# Altium schematic sheet Proyecto_Multicapa_Schematic_2.SchDoc
size Letter; DrawnBy: Stefano Papadopolo; Organization: UVG; Revision: 0; SheetNumber: 2; SheetTotal: 2
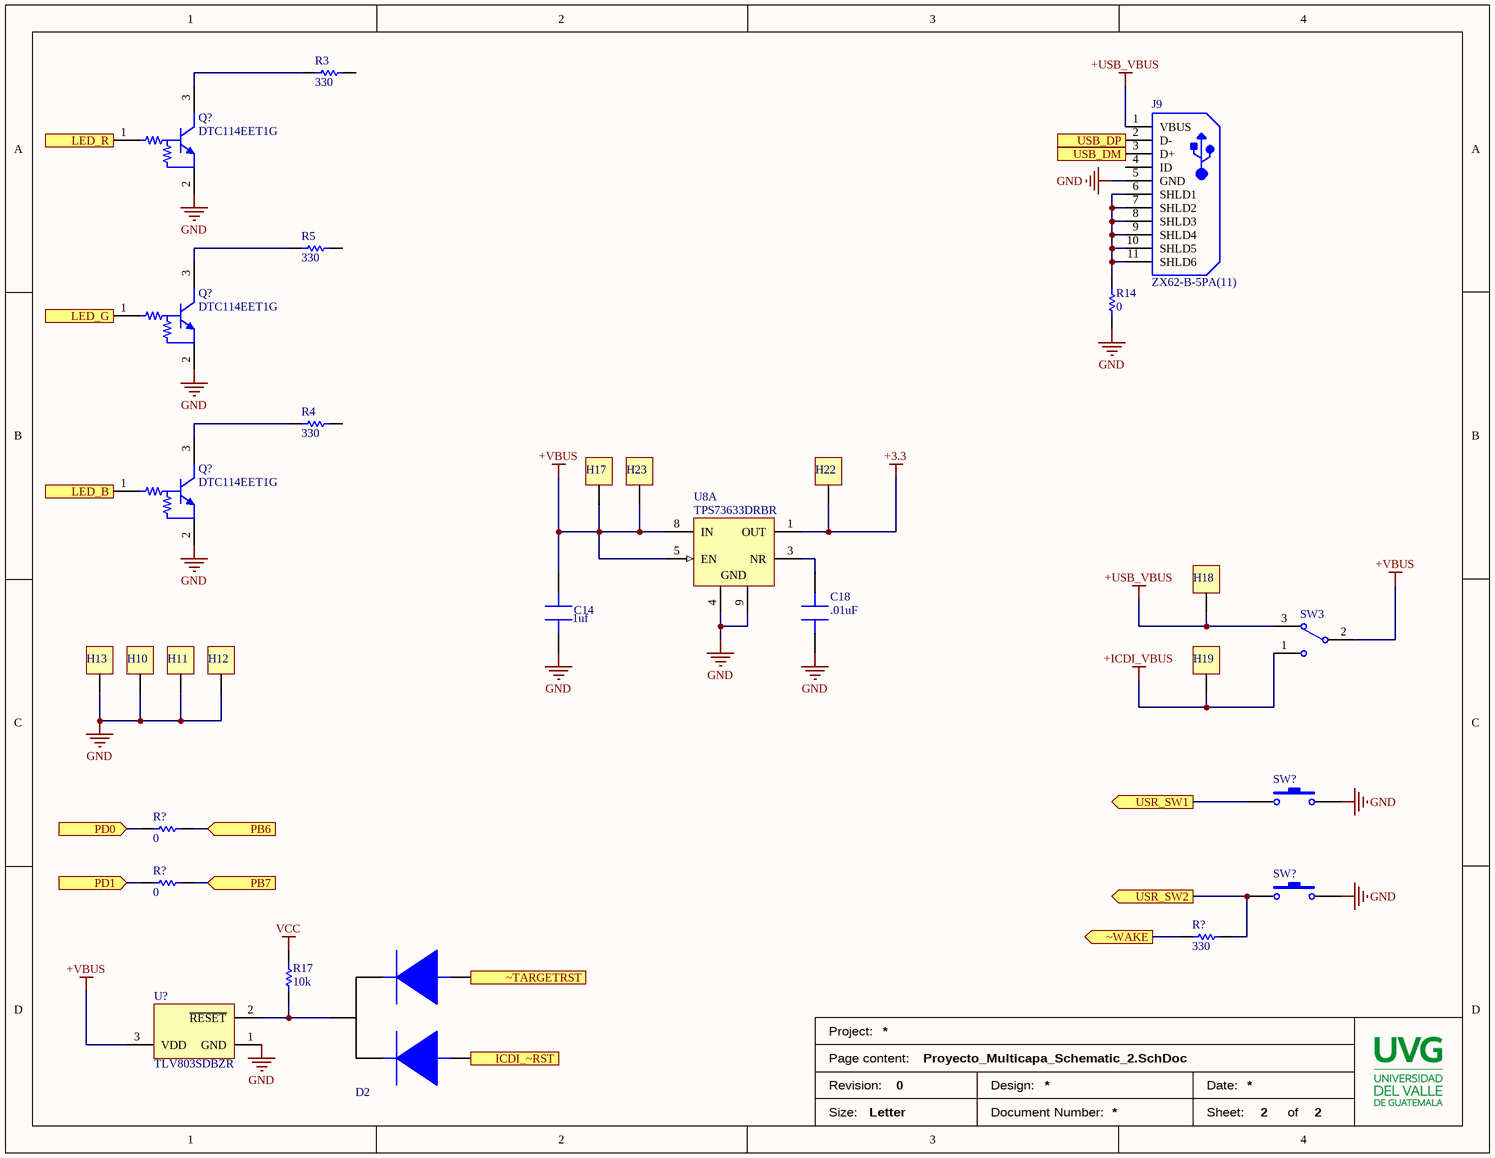
[diagram p0: Proyecto_Multicapa_Schematic_2.SchDoc]

## Parts
(Parts that share a designator on the sheet are numbered #1, #2 ... from top to bottom, then left to right.)
C14  1uf  [C0402]
C18  .01uF  [C0402]
D2  Diode, Dual Schottky, SC70  [Diode, dual shottky]  (value not drawn)
H10  HDR1  [HDR 1X1]  (value not drawn)
H11  HDR1  [HDR 1X1]  (value not drawn)
H12  HDR1  [HDR 1X1]  (value not drawn)
H13  HDR1  [HDR 1X1]  (value not drawn)
H17  HDR1  [HDR 1X1]  (value not drawn)
H18  HDR1  [HDR 1X1]  (value not drawn)
H19  HDR1  [HDR 1X1]  (value not drawn)
H22  HDR1  [HDR 1X1]  (value not drawn)
H23  HDR1  [HDR 1X1]  (value not drawn)
J9  ZX62-B-5PA(11)  [HIRO-ZX62-B-5PA_V]
Q?#1  DTC114EET1G  [ONSC-SC-75-3-463-01_V]
Q?#2  DTC114EET1G  [ONSC-SC-75-3-463-01_V]
Q?#3  DTC114EET1G  [ONSC-SC-75-3-463-01_V]
R3  330  [Resis 1M]
R4  330  [Resis 1M]
R5  330  [Resis 1M]
R14  0  [Resis 1M]
R17  10k  [Resis 1M]
R?#1  0  [Resis 1M]
R?#2  0  [Resis 1M]
R?#3  330  [Resis 1M]
SW3  SW-SPDT  [TL36WW15050]  (value not drawn)
SW?#1  SW-PB  [SPST-2]  (value not drawn)
SW?#2  SW-PB  [SPST-2]  (value not drawn)
U8  TPS73633DRBR  [DRB0008A_V]  (part A of 2)
U?  TLV803SDBZR  [DBZ0003A_M]

## Ports
ICDI_~RST (out), LED_B (out), LED_G (out), LED_R (out), PB6 (in), PB7 (in), PD0 (in), PD1 (in), USB_DM (out), USB_DP (out), USR_SW1 (out), USR_SW2 (out), ~TARGETRST (out), ~WAKE (out)

## Nets
+3.3: H22.1 U8.1(OUT)
+ICDI_VBUS: H19.1 SW3.1
+USB_VBUS: H18.1 J9.1(VBUS) SW3.3
+VBUS: C14.1 H17.1 H23.1 SW3.2 U8.5(EN) U8.8(IN) U?.3(VDD)
GND: C14.0 C18.0 H10.1 H11.1 H12.1 H13.1 J9.5(GND) Q?#1.2(E) Q?#2.2(E) Q?#3.2(E) R14.1 SW?#1.2 SW?#2.2 U8.4(GND) U8.9(GND) U?.1(GND)
VCC: R17.2
ICDI_~RST: D2.1 ; port ICDI_~RST
LED_B: Q?#3.1(B) ; port LED_B
LED_G: Q?#2.1(B) ; port LED_G
LED_R: Q?#1.1(B) ; port LED_R
PB6: R?#1.2 ; port PB6
PB7: R?#2.2 ; port PB7
PD0: R?#1.1 ; port PD0
PD1: R?#2.1 ; port PD1
USB_DM: J9.3(D+) ; port USB_DM
USB_DP: J9.2(D-) ; port USB_DP
USR_SW1: SW?#1.1 ; port USR_SW1
USR_SW2: R?#3.2 SW?#2.1 ; port USR_SW2
~TARGETRST: D2.2 ; port ~TARGETRST
~WAKE: R?#3.1 ; port ~WAKE
NetC18_1: C18.1 U8.3(NR)
NetD2_3: D2.3 R17.1 U?.2(~{RESET})
NetJ9_6: J9.6(SHLD1) J9.7(SHLD2) J9.8(SHLD3) J9.9(SHLD4) J9.10(SHLD5) J9.11(SHLD6) R14.2
NetQ?#1_3: Q?#1.3(C) R3.1
NetQ?#2_3: Q?#2.3(C) R5.1
NetQ?#3_3: Q?#3.3(C) R4.1

Not connected (* = marked no-connect by the designer): J9 4(ID); R3 2; R4 2; R5 2

## Notes on the sheet
- Project:
- Page content:
- Revision:
- Size:
- Letter
- Design:
- Document Number:
- Date:
- Sheet:
- of

## Library data of the parts
C14 = 100R07X105KV4T: Multilayer Ceramic Capacitor, Tanceram Series, 1 - F, - 10%, X5R, 10 V, 0402 [1005 Metric]; Manufacturer: Johanson; Voltage Rating: 10V; Supplier 1: Mouser; Manufacturer Part Number: 100R07X105KV4T; Stock 1: 61365; Pricing 1: 1 = 0.28000, 10 = 0.19300, 50 = 0.19300, 100 = 0.09800, 500 = 0.06700, 1000 = 0.06000, 2500 = 0.05700, 5000 = 0.05200, 10000 = 0.04800 (USD); RoHS: Yes; Mount: Surface Mount; Case/Package: 0402; Number of Pins: 2; Case Code (Metric): 1005; Case Code (Imperial): 0402; Weight: 2.3E-05oz; Min Operating Temperature: -55°C; Max Operating Temperature: 85°C; Capacitance: 1uF; Tolerance: 10%; Packaging: Tape and Reel; Package Quantity: 10000; Voltage Rating (DC): 10V; Dielectric: X5R; Termination: SMD/SMT; Series: TANCERAM®; Length: 1.02mm; Width: 0.02inch; Height: 0.64mm; Thickness: 0.025inch; Depth: 0.51mm; Radiation Hardening: No; REACH SVHC: No SVHC; RoHS Compliant: Yes; ComponentLink1URL: https://datasheet.ciiva.com/26948/getdatasheetpartid-789067-26948543.pdf?src-supplier=Verical; ComponentLink1Description: https://datasheet.ciiva.com/26948/getdatasheetpartid-789067-26948543.pdf?src-supplier=Verical; ComponentLink2URL: https://datasheet.ciiva.com/22693/jdi-full-catalog-2012-01-22693744.pdf?src-supplier=Element14; ComponentLink2Description: https://datasheet.ciiva.com/22693/jdi-full-catalog-2012-01-22693744.pdf?src-supplier=Element14; Supplier Part Number 1: 605-100R07X105KV4T
C18 = TMK105B7103KV-F: 0402 0.01 uF 25 V ±10% X7R Automotive Multilayer Ceramic Capacitor; Manufacturer: Taiyo Yuden; Capacitance: 10nF; Voltage Rating: 25V; Supplier 1: Newark; Manufacturer Part Number: TMK105B7103KV-F; Stock 1: 2; Pricing 1: 1 = 0.00200, 25 = 0.00200, 100 = 0.00200, 250 = 0.00200, 500 = 0.00200, 1000 = 0.00200, 2500 = 0.00200, 5000 = 0.00200 (USD); RoHS: Yes; Mount: Surface Mount; Case/Package: 0402; Case Code (Metric): 1005; Case Code (Imperial): 0402; Contact Plating: Tin; Min Operating Temperature: -55°C; Max Operating Temperature: 125°C; Tolerance: 10%; Package Quantity: 1; Packaging: Tape and Reel; Voltage Rating (DC): 25V; Dielectric: X7R; Termination: SMD/SMT; Resistor Type: Ceramic; Series: M; Construction: Flat; Voltage: 25V; Length: 1mm; Width: 0.02inch; Height: 0.5mm; Thickness: 0.022inch; Depth: 0.5mm; REACH SVHC: Unknown; Halogen Free: Halogen Free; RoHS Compliant: Yes; ComponentLink1URL: https://datasheet.ciiva.com/129/tmk105b7103kv-f-ss-129699.pdf?src-supplier=Digi-Key; ComponentLink1Description: https://datasheet.ciiva.com/129/tmk105b7103kv-f-ss-129699.pdf?src-supplier=Digi-Key; ComponentLink2URL: https://datasheet.ciiva.com/30192/438tmk105b7103kv-f-30192315.pdf?src-supplier=Onlinecomponents.com; ComponentLink2Description: https://datasheet.ciiva.com/30192/438tmk105b7103kv-f-30192315.pdf?src-supplier=Onlinecomponents.com; ComponentLink3URL: https://datasheet.ciiva.com/15922/204tmk105b7103kv-f-15922348.pdf?src-supplier=Onlinecomponents.com; ComponentLink3Description: https://datasheet.ciiva.com/15922/204tmk105b7103kv-f-15922348.pdf?src-supplier=Onlinecomponents.com; ComponentLink4URL: https://datasheet.ciiva.com/30156/190tmk105b7103kv-f-30156174.pdf?src-supplier=Onlinecomponents.com; ComponentLink4Description: https://datasheet.ciiva.com/30156/190tmk105b7103kv-f-30156174.pdf?src-supplier=Onlinecomponents.com; ComponentLink5URL: https://datasheet.ciiva.com/28645/746258-28645254.pdf?src-supplier=Element14; ComponentLink5Description: https://datasheet.ciiva.com/28645/746258-28645254.pdf?src-supplier=Element14; ComponentLink6URL: https://datasheet.ciiva.com/7975/746258-7975835.pdf?src-supplier=Element14; ComponentLink6Description: https://datasheet.ciiva.com/7975/746258-7975835.pdf?src-supplier=Element14; Supplier Part Number 1: 77M8496
D2 = BAS70W-05-7-F: BAS70W Series 70 V 70 mA Surface Mount Schottky Barrier Diode - SOT-323; Manufacturer: Diodes; Element Configuration: Common Cathode; Forward Current: 70mA; Reverse Recovery Time: 5ns; Max Repetitive Reverse Voltage (Vrrm): 70V; Peak Non-Repetitive Surge Current: 100mA; Max Power Dissipation: 200mW; Forward Voltage: 1V; Max Reverse Current: 100nA; Capacitance: 2pF; Supplier 1: Digi-Key; Manufacturer Part Number: BAS70W-05-7-F; Stock 1: 289; Pricing 1: 1 = 0.39000, 10 = 0.32300, 100 = 0.17120, 500 = 0.11262, 1000 = 0.07658 (USD); RoHS: Yes; Mount: Surface Mount; Case/Package: SOT-323; Number of Pins: 3; Weight: 0.000212oz; Contact Plating: Tin,Matte; Min Operating Temperature: -55°C; Max Operating Temperature: 125°C; Packaging: Tape and Reel; Package Quantity: 3000; Average Rectified Current: 70mA; Max Forward Surge Current (Ifsm): 100mA; Power Dissipation: 200mW; Termination: SMD/SMT; Current Rating: 70mA; Power Rating: 200mW; Voltage Rating (DC): 70V; Max Reverse Voltage (DC): 70V; Series: -; Length: 2.2mm; Width: 1.35mm; Height: 1mm; Radiation Hardening: No; Lead Free: Lead Free; RoHS Compliant: Yes; ComponentLink1URL: https://datasheet.ciiva.com/8303/ds30113-8303106.pdf?src-supplier=Avnet; ComponentLink1Description: https://datasheet.ciiva.com/8303/ds30113-8303106.pdf?src-supplier=Avnet; ComponentLink2URL: https://datasheet.ciiva.com/4715/ds30113-42118-4715778.pdf?src-supplier=Mouser; ComponentLink2Description: https://datasheet.ciiva.com/4715/ds30113-42118-4715778.pdf?src-supplier=Mouser; ComponentLink3URL: https://datasheet.ciiva.com/16574/ds30113-16574275.pdf?src-supplier=Avnet+Europe; ComponentLink3Description: https://datasheet.ciiva.com/16574/ds30113-16574275.pdf?src-supplier=Avnet+Europe; ComponentLink4URL: https://datasheet.ciiva.com/6388/ds30113-6388462.pdf?src-supplier=Digi-Key; ComponentLink4Description: https://datasheet.ciiva.com/6388/ds30113-6388462.pdf?src-supplier=Digi-Key; Supplier Part Number 1: BAS70W-05FDICT-ND
H10-H13 H17-H19 H22 H23 = Header 1x1: Header 1x1, hole
J9 = CMP-2000-05146-1: Micro USB-B Receptacle Connector, Right Angle, 30 V, -30 to 85 degC, 5-Pin SMD, RoHS, Tape and Reel; Manufacturer: Hirose Electric; DELETED: Compliant; Voltage Rating Max: 30VAC; Number of Contacts: 5POS; Pitch (mm): 0.65mm; Current Rating (Max): 1/ContactA; Gender: RCP; Product Depth (mm): 5.6mm; Product Length (mm): 7.9mm; Product Diameter (mm): NotRequiredmm; Number of Ports: 1Port; Product Height (mm): 2.8mm; Body Orientation: RightAngle; Datasheet Version: Jul-08; Packaging: TapeandReel; Mounting Style: SurfaceMount; Datasheet URL: https://datasheet.ciiva.com/11731/0900766b80d9c4df-11731324.pdf; Package Reference: ZX62-B-5PA; Termination Method: Solder; Number of Terminals: 5; Operating Temp Range: -30Cto85C; Type: MicroUSBTypeB; Contact Material: CopperAlloy; Manufacturer URL: https://www.hirose.com; Contact Plating: Gold; Package Description: 5-Pin Surface Mount Device, Body 7.9 x 5 mm, Pitch 0.65 mm; Operating Temperature Min Deg. C: -30C; Operating Temperature Max Deg. C: 85C
Q?#1-Q?#3 = CMP-0630-00210-1: Digital Transistor (BRT), R1=10 kOhm, R2=10 kOhm, NPN Transistor, 3-Pin SC-75, Pb-Free, Tape and Reel; Manufacturer: On Semiconductor; IC Continuous (A): 0.1; hFE Min: 35; V(BR)CEO Min (V): 50; R1/R2 Typ: 1; Mounting Technology: Surface Mount; RoHS: TRUE; Packing: Tape and Reel; DatasheetVersion: Rev. 5; ComponentLink1Description: Manufacturer URL; ComponentLink3Description: Package Specification; PartNumber: DTC114EET1G; PackageReference: SC-75-3-463-01; PackageVersion: Rev. F, 07/2005; ComponentLink1URL: http://www.onsemi.com/; Polarity: NPN; ComponentLink3URL: http://www.onsemi.com/pub_link/Collateral/463-01.PDF; ComponentLink2Description: Datasheet; PackageDescription: 3-Pin Small Outline Transistor, Body 1.6 x 0.8 mm, Pitch 0.5 mm; ComponentLink2URL: http://www.onsemi.cn/pub_link/Collateral/DTC114E-D.PDF
R3-R5 R14 R17 R?#1-R?#3 = MCR01MRTF1004: Res Thick Film 0402 1M Ohm 1% 0.063W(1/16W) ±100ppm/C Pad SMD T/R; Manufacturer: Rohm; Resistance: 1MR; Max Power Dissipation: 63mW; Temperature Coefficient: 100ppm/°C; Voltage Rating (DC): 50V; Supplier 1: Digi-Key; Manufacturer Part Number: MCR01MRTF1004; Stock 1: 0; RoHS: Yes; Case/Package: 0402; Case Code (Metric): 1005; Case Code (Imperial): 0402; Min Operating Temperature: -55°C; Max Operating Temperature: 155°C; Package Quantity: 1; Tolerance: 1%; Packaging: Tape and Reel; Resistor Type: Thick Film; Number of Terminations: 2; Series: MCR; Length: 0.039inch; Width: 0.02inch; Height: 0.016inch; Lead Free: Lead Free; RoHS Compliant: Yes; ComponentLink1URL: https://datasheet.ciiva.com/2519/mcr01mrt-seriesspec-2519945.pdf?src-supplier=Digi-Key; ComponentLink1Description: https://datasheet.ciiva.com/2519/mcr01mrt-seriesspec-2519945.pdf?src-supplier=Digi-Key; ComponentLink2URL: https://datasheet.ciiva.com/2519/mcr01mrt-seriesspec-2519946.pdf?src-supplier=Digi-Key; ComponentLink2Description: https://datasheet.ciiva.com/2519/mcr01mrt-seriesspec-2519946.pdf?src-supplier=Digi-Key; ComponentLink3URL: https://datasheet.ciiva.com/2519/mcr01mrt-seriesspec-2519947.pdf?src-supplier=Digi-Key; ComponentLink3Description: https://datasheet.ciiva.com/2519/mcr01mrt-seriesspec-2519947.pdf?src-supplier=Digi-Key; Supplier Part Number 1: RHM1.00MCDCT-ND
SW3 = SW-SPDT: SPDT Subminiature Toggle Switch, Right Angle Mounting, Vertical Actuation; Published: 24-Mar-1999; LatestRevisionDate: 17-Dec-2003; LatestRevisionNote: Schematic revised, PCB Footprint replaced.; DatasheetVersion: 05-Dec-2000; PackageReference: TL36WW15050; Publisher: Altium Limited; PackageDescription: Switch; 4 Leads; ComponentLink1Description: Manufacturer Link; ComponentLink1URL: http://www.apem.com
SW?#1 SW?#2 = SW-PB: Switch; Published: 24-Mar-1999; LatestRevisionDate: 17-Jul-2002; LatestRevisionNote: Re-released for DXP Platform.; PackageReference: SPST-2; Publisher: Altium Limited; PackageDescription: Switch; 2 Leads
U8 = CMP-0395-00621-2: Single Output Low Noise LDO, 400 mA, Fixed 3.3 V Output, 1.7 to 5.5 V Input, with Reverse Current Protection, 8-pin SON (DRB), -40 to 85 degC, Green (RoHS & no Sb/Br); Manufacturer: Texas Instruments; Fixed Output Options(V): 3.3; Rating: Catalog; Accuracy(%): 1; Vdo(Typ)(mV): 75; SubFamily: Single Channel LDO; Vin(Min)(V): 1.7; Iq(Typ)(mA): 0.3; Vin(Max)(V): 5.5; Iout(Max)(A): 0.4; ComponentLink4URL: Samples URL:http://www.ti.com/product/tps73633#samples; PackageDescription: 8-Pin Plastic Small Outline, Body 3 x 3 mm, Pitch 0.65 mm; ComponentLink4Description: URL Link1; PackageReference: DRB0008A; Eco-Plan: Green (RoHS & no Sb/Br); ComponentLink1URL: http://www.ti.com/; PartNumber: TPS73633DRBR; Vout Adj(Max)(V): 3.3; ComponentLink3Description: Package Specification; ComponentLink3URL: http://www.ti.com/litv/pdf/mpds118h; PackageVersion: 4203482-2/K; ComponentLink2Description: Datasheet; DatasheetVersion: SBVS038T; Vout Adj(Min)(V): 3.3; Mounting Technology: Surface Mount; ComponentLink2URL: http://www.ti.com/general/docs/lit/getliterature.tsp?genericPartNumber=TPS73633&fileType=pdf; ComponentLink1Description: Manufacturer URL
U? = CMP-0332-00609-2: Voltage Supervisor with Active-Low, Open Drain Reset, 1 Supply Monitored, -40 to 125 degC, 3-pin SOT-23 (DBZ), Green (RoHS & no Sb/Br); Manufacturer: Texas Instruments; Time Delay(ms): 200; Output Driver Type / Reset Output: Active-low, Open-drain; Rating: Catalog; VCC(Min)(V): 1.1; VCC(Max)(V): 6; Threshold Voltage 1 (typ)(Typ)(V): 2.93; SubFamily: Supervisor and Reset IC; # of Supplies Monitored: 1; Iq(Typ)(uA): 9; Reset Threshold Accuracy(%): 2; PackageDescription: 3-Pin Plastic Small-Outline Package, 0.95 mm Pitch, 2.4 mm Lead Span; Mounting Technology: Surface Mount; ComponentLink1Description: Datasheet; Code_JEDEC: TO-236-AB; PackageReference: DBZ0003A; PartNumber: TLV803SDBZR; PackageVersion: revB, Apr-2005; DatasheetVersion: SBVS157B; ComponentLink1URL: http://www.ti.com/general/docs/lit/getliterature.tsp?genericPartNumber=TLV803S&fileType=pdf